# Altium project TSFF5210.PrjPCB
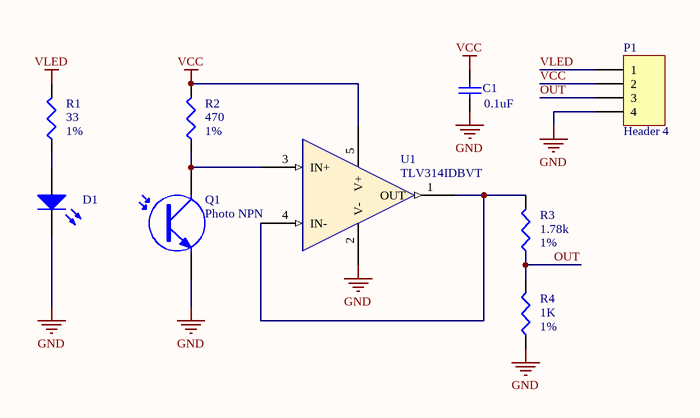
[diagram p0: TSFF5210.SchDoc]
1 sheet, 9 parts. Net scope: global (net labels, ports and power ports of the same name join across sheets).
Board file: TSFF5210.PcbDoc

## Sheet TSFF5210.SchDoc
size A

### Parts
C1  value 0.1uF  [J1-0603]  (hidden comment: Cap)
D1  LED0  [LED-5mm]  (value not drawn)
P1  Header 4  [HDR1X4]
Q1  Photo NPN  [LED-5mm]
R1  value 33  Tolerance: 1%  [1206]  (hidden comment: Res3)
R2  value 470  Tolerance: 1%  [J1-0603]  (hidden comment: Res3)
R3  value 1.78k  Tolerance: 1%  [J1-0603]  (hidden comment: Res3)
R4  value 1K  Tolerance: 1%  [J1-0603]  (hidden comment: Res3)
U1  TLV314IDBVT  [SOT23-5]

### Nets
GND: C1.1 D1.2(K) P1.4 Q1.1(E) R4.1 U1.2(V-)
VCC: C1.2 P1.2 R2.2 U1.5(V+)
VLED: P1.1 R1.2
OUT: P1.3 R3.1 R4.2
NetD1_1: D1.1(A) R1.1
NetQ1_2: Q1.2(C) R2.1 U1.3(IN+)
NetR3_2: R3.2 U1.1(OUT) U1.4(IN-)

### Library data of the parts
C1 = Cap: Capacitor; Published: 8-Jun-2000; LatestRevisionDate: 17-Jul-2002; LatestRevisionNote: Re-released for DXP Platform.; PackageReference: RAD-0.3; Publisher: Altium Limited; PackageDescription: Radial Cap, Thru-Hole; 2 Leads; 0.3 in Pin Spacing; Supplier 1: Digi-Key; Supplier Part Number 1: 311-1088-1-ND
D1 = LED0: Typical INFRARED GaAs LED; Published: 8-Jun-2000; LatestRevisionDate: 08-Jul-2005; LatestRevisionNote: Mech Layer 1 removed.; PackageReference: LED-0; Publisher: Altium Limited; PackageDescription: LED; 2 Leads; Supplier 1: Digi-Key; Supplier Part Number 1: 751-1207-ND
P1 = Header 4: Header, 4-Pin; LatestRevisionDate: 17-Jul-2002; LatestRevisionNote: Re-released for DXP Platform.; Publisher: Altium Limited
Q1 = Photo NPN: NPN Phototransistor; Published: 24-Mar-1999; LatestRevisionDate: 17-Jul-2002; LatestRevisionNote: Re-released for DXP Platform.; PackageReference: TO-220_A; Publisher: Altium Limited; Code_JEDEC: TO-220-AC
R1-R4 = Res3: Resistor; Published: 8-Jun-2000; LatestRevisionDate: 29-May-2009; LatestRevisionNote: IPC-7351 Footprint Added.; PackageReference: J1-0603; Publisher: Altium Limited; PackageDescription: Chip Resistor; Supplier 1: Digi-Key
  R1: Supplier Part Number 1: RHM33.0AFCT-ND
  R2: Supplier Part Number 1: 311-47.0HRCT-ND
  R3: Supplier Part Number 1: 311-17.8KHRCT-ND
  R4: Supplier Part Number 1: 311-1.00KHRCT-ND